# EAGLE schematic BLE Shield v1.0 (EAGLE 6.4)
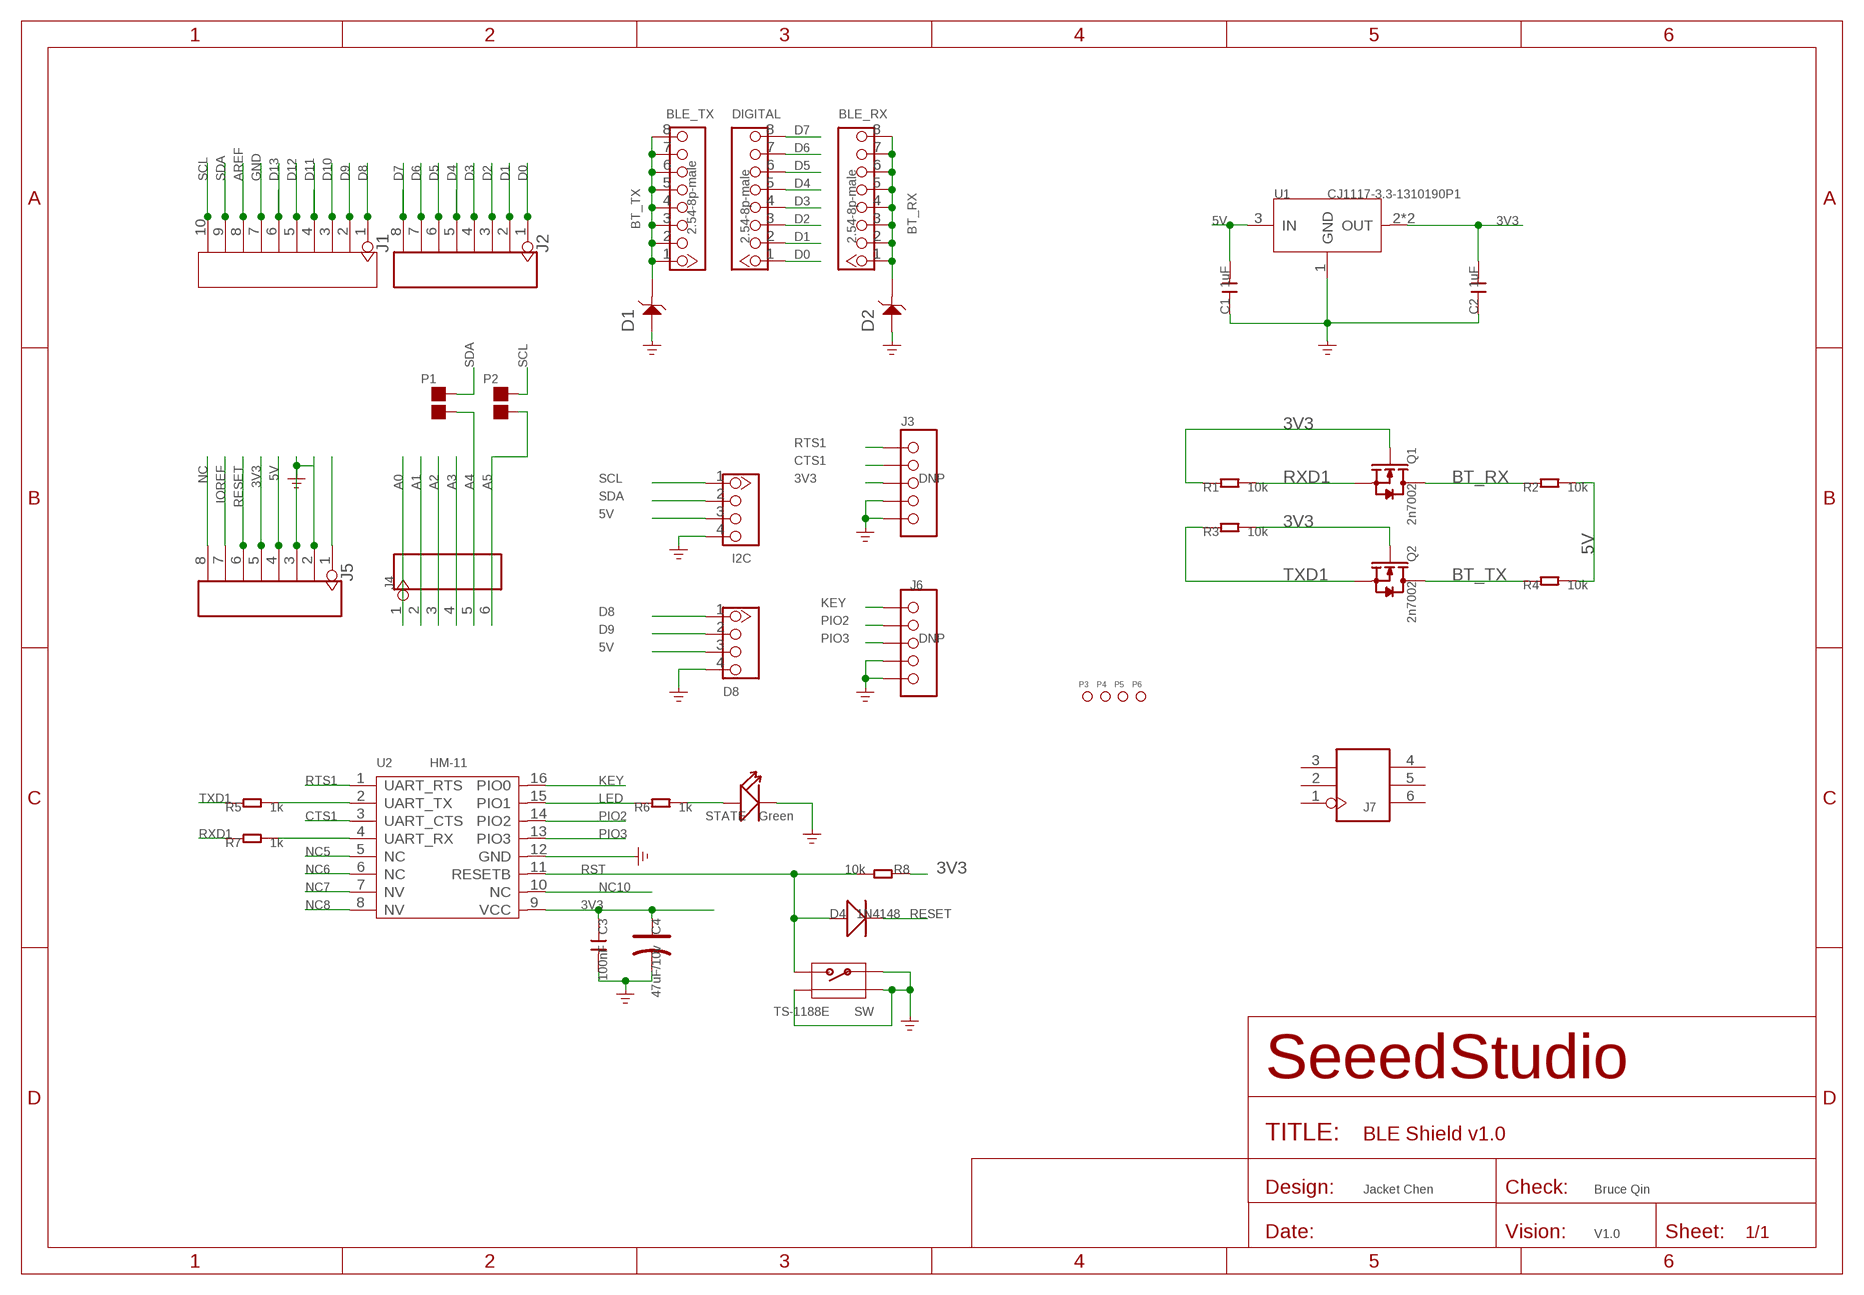
[diagram p0: schematic, sheet 1]

## Parts
BLE_RX  2.54-8p-male  HEADER-8P-2.54  [8P-2.54]
BLE_TX  2.54-8p-male  HEADER-8P-2.54  [8P-2.54]
C1  1uF  C-0603  [C0603]
C2  1uF  C-0603  [C0603]
C3  100nF  C-0603  [C0603]
C4  47uF/10v  CAP-AVX-A  [AVX-A]
D1  6.2V/250mW  D-ESD-2P'CESD5V0D1'  [SOD123-2.7X1.6]
D2  6.2V/250mW  D-ESD-2P'CESD5V0D1'  [SOD123-2.7X1.6]
D4  1N4148  D'1N4148-SMD'  [LL-34]
D8  DIP Grove  TWIG-4P-2.0-2.0  [4P-2.0]
DIGITAL  2.54-8p-male  HEADER-8P-2.54  [8P-2.54]
I2C  DIP Grove  TWIG-4P-2.0-2.0  [4P-2.0]
J1  DIP Long Blue Female Header  HEADER-10P-2.54  [10P-2.54]
J2  DIP Long Blue Female Header  HEADER-8P-65/35MIL  [8P-2.54-65/35MIL]
J3  DNP  HEADER-5P-2.54  [5P-2.54]
J4  DIP Long Blue Female Header  HEADER-6P-65/35MIL  [6P-2.54-65/35MIL]
J5  DIP Long Blue Female Header  HEADER-8P-65/35MIL  [8P-2.54-65/35MIL]
J6  DNP  HEADER-5P-2.54  [5P-2.54]
J7  DIP Long Blue Female Header  HEADER-2X3P-65/35MIL  [2X3P-2.54-65/35MIL]
P1  DNP  PAD-JUMPER-2P  [2P-SMD-1.78X1.27]
P2  DNP  PAD-JUMPER-2P  [2P-SMD-1.78X1.27]
P3  PAD-MARK  [ROUND-MARK-1.0]
P4  PAD-MARK  [ROUND-MARK-1.0]
P5  PAD-MARK  [ROUND-MARK-1.0]
P6  PAD-MARK  [ROUND-MARK-1.0]
Q1  2n7002  MOSFET-N'SOT23'  [SOT23]
Q2  2n7002  MOSFET-N'SOT23'  [SOT23]
R1  10k  R-0603  [R0603]
R2  10k  R-0603  [R0603]
R3  10k  R-0603  [R0603]
R4  10k  R-0603  [R0603]
R5  1k  R-0603  [R0603]
R6  1k  R-0603  [R0603]
R7  1k  R-0603  [R0603]
R8  10k  R-0603  [R0603]
STATE  Green  LED'0603'  [LED-0603]
SW  TS-1188E  BUTTON-4P-REINFORCE'TS-1188E'  [4P-SMD-7X3.5X3.5H]
U1  CJ1117-3.3-1310190P1  [SOT223]
U2  HM-11  [16P-18.5X13.5X0.8]

## Nets
3V3: C2.2 C3.1 C4.+ J3.3 J5.5 Q1.1(G) Q2.1(G) R1.1 R3.2 R8.1 U1.2(OUT) U1.TER(OUT) U2.9(VCC)
5V: C1.2 D8.3 I2C.3 J5.4 R2.2 R4.2 U1.3(IN)
A0: J4.1
A1: J4.2
A2: J4.3
A3: J4.4
A4: J4.5 P1.1
A5: J4.6 P2.1
AREF: J1.8
BT_RX: BLE_RX.1 BLE_RX.2 BLE_RX.3 BLE_RX.4 BLE_RX.5 BLE_RX.6 BLE_RX.7 BLE_RX.8 D2.2 Q1.3(D) R2.1
BT_TX: BLE_TX.1 BLE_TX.2 BLE_TX.3 BLE_TX.4 BLE_TX.5 BLE_TX.6 BLE_TX.7 BLE_TX.8 D1.2 Q2.3(D) R4.1
CTS1: J3.2 U2.3(UART_CTS)
D0: DIGITAL.1 J2.1
D1: DIGITAL.2 J2.2
D2: DIGITAL.3 J2.3
D3: DIGITAL.4 J2.4
D4: DIGITAL.5 J2.5
D5: DIGITAL.6 J2.6
D6: DIGITAL.7 J2.7
D7: DIGITAL.8 J2.8
D8: D8.1 J1.1
D9: D8.2 J1.2
D10: J1.3
D11: J1.4
D12: J1.5
D13: J1.6
GND: C1.1 C2.1 C3.2 C4.- D1.1 D2.1 D8.4 I2C.4 J1.7 J3.4 J3.5 J5.2 J5.3 J6.4 J6.5 STATE.- SW.1 SW.S1 SW.S2 U1.1(GND) U2.12(GND)
IOREF: J5.7
KEY: J6.1 U2.16(PIO0)
LED: R6.1 U2.15(PIO1)
N$1: J5.1
N$2: R6.2 STATE.+
N$3: R5.2 U2.2(UART_TX)
N$6: R7.2 U2.4(UART_RX)
NC: J5.8
NC5: U2.5(NC)
NC6: U2.6(NC)
NC7: U2.7(NV)
NC8: U2.8(NV)
NC10: U2.10(NC)
PIO2: J6.2 U2.14(PIO2)
PIO3: J6.3 U2.13(PIO3)
RESET: D4.C(-) J5.6
RST: D4.A(+) R8.2 SW.2 U2.11(RESETB)
RTS1: J3.1 U2.1(UART_RTS)
RXD1: Q1.2(S) R1.2 R7.1
SCL: I2C.1 J1.10 P2.2
SDA: I2C.2 J1.9 P1.2
TXD1: Q2.2(S) R3.1 R5.1
Unconnected: J7.1 J7.2 J7.3 J7.4 J7.5 J7.6

## Notes on the sheet
- Jacket Chen | Bruce Qin
- V1.0

## Library data of the parts
BLE_RX BLE_TX DIGITAL = Connector:HEADER-8P
C1-C3 = Discrete:C*: Ceramic Capacitors
C4 = Discrete:CAP*: Electrolytic Capacitors,Tantalum Capacitors and Super Capacitors
D1 D2 = Discrete:D-ESD-2P: Diodes for Protectiong against ESD
D4 = Discrete:D*
D8 I2C = Connector:TWIG-4P-2.0
J1 = Connector :HEADER-10P
J2 J5 = Connector :HEADER-8P
J3 J6 = Connector:HEADER-5P
J4 = Connector :HEADER-6P
J7 = Connector :HEADER-2X3P
P1 P2 = Discrete:PAD-JUMPER-2P; PARTNO: DNP
P3-P6 = Discrete:PAD-MARK; PARTNO: DNP
Q1 Q2 = Discrete:MOSFET-N: IRLL014: http://www.vishay.com/docs/91319/sihll014.pdf
R1-R8 = Discrete:R*
STATE = Discrete:LED*
SW = Discrete:BUTTON-4P-REINFORCE: TS-1188E http://www.best-dz.com/?thread-374-2.html
U1 = OPL:CJ1117-3.3: 1A Low Dropout Linear Regulator
U2 = template:HM-11: Bluetooth Specification V4.0 BLE

## Net classes
0 default: width 0.203 mm, drill 0.305 mm, clearance 0.152 mm
3 usbvcc: width 0.203 mm, drill 0.305 mm, clearance 0.203 mm